# EAGLE design Four Motor Rev F (EAGLE 9.6.2)
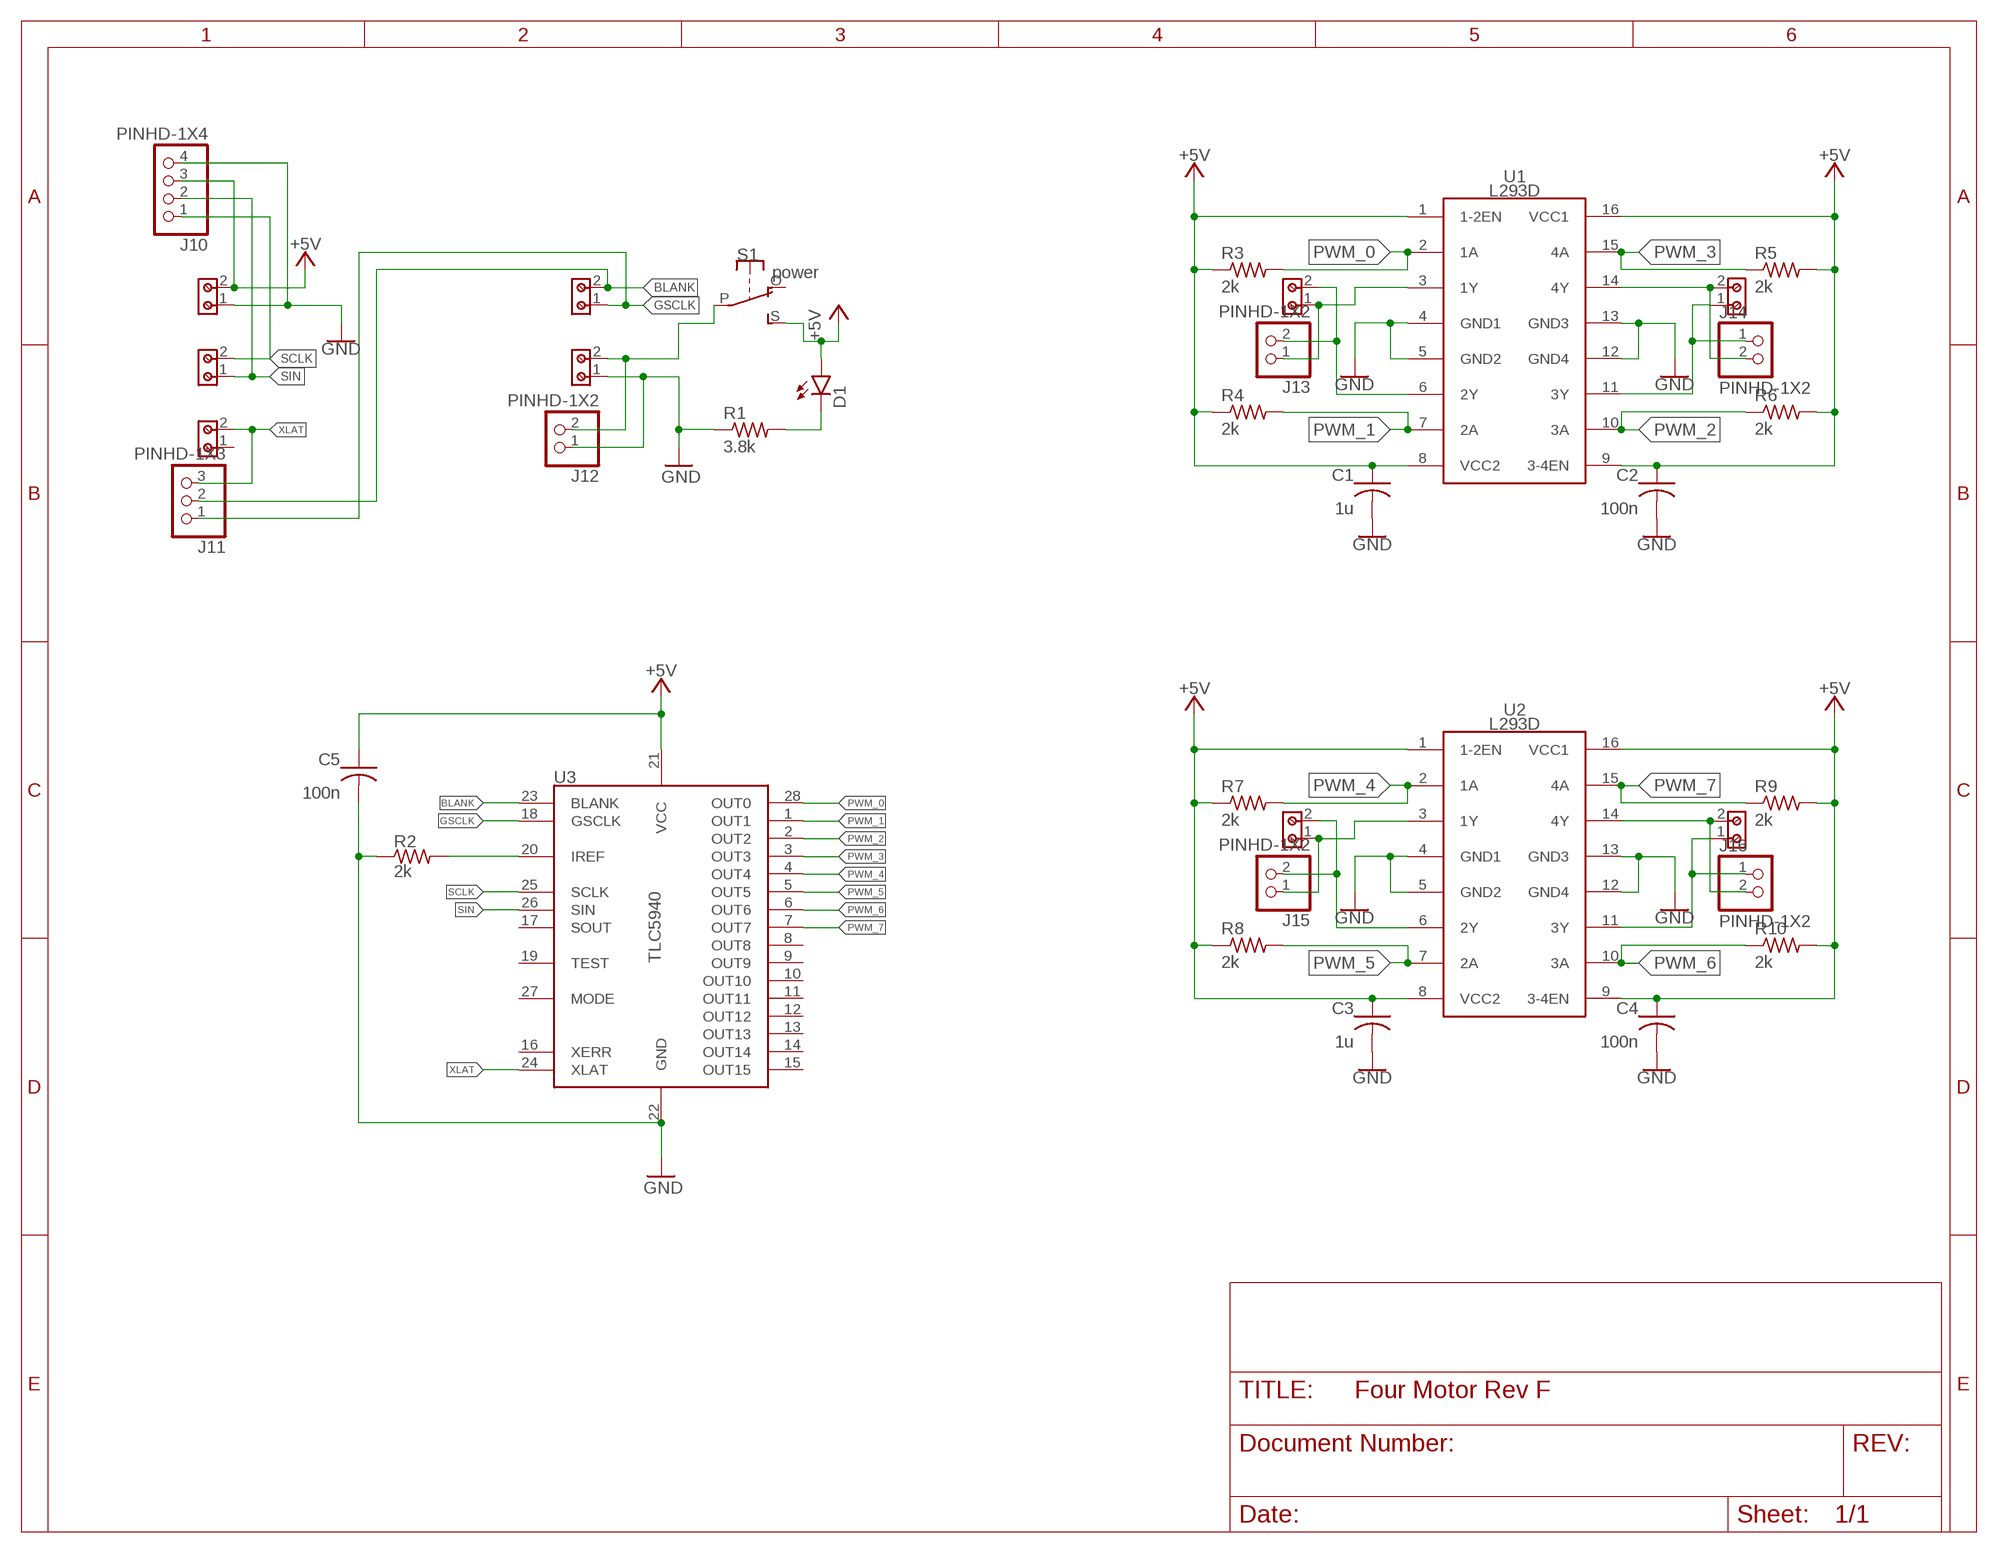
[diagram p0: schematic, sheet 1]

## Parts
C1  1u  THT-CER-CAPACITOR  [C050-024X044]
C2  100n  THT-CER-CAPACITOR  [C050-024X044]
C3  1u  THT-CER-CAPACITOR  [C050-024X044]
C4  100n  THT-CER-CAPACITOR  [C050-024X044]
C5  100n  THT-CER-CAPACITOR  [C050-024X044]
D1  LED  [LED5MM]
J1  691214110002  [691214110002]
J2  691214110002  [691214110002]
J3  691214110002  [691214110002]
J4  691214110002  [691214110002]
J5  691214110002  [691214110002]
J6  691214110002  [691214110002]
J7  691214110002  [691214110002]
J8  691214110002  [691214110002]
J9  691214110002  [691214110002]
J10  PINHD-1X4  [1X04]
J11  PINHD-1X3  [1X03]
J12  PINHD-1X2  [1X02]
J13  PINHD-1X2  [1X02]
J14  PINHD-1X2  [1X02]
J15  PINHD-1X2  [1X02]
J16  PINHD-1X2  [1X02]
R1  3.8k  RESISTOR  [0207/10]
R2  2k  RESISTOR  [0207/10]
R3  2k  RESISTOR  [0207/10]
R4  2k  RESISTOR  [0207/10]
R5  2k  RESISTOR  [0207/10]
R6  2k  RESISTOR  [0207/10]
R7  2k  RESISTOR  [0207/10]
R8  2k  RESISTOR  [0207/10]
R9  2k  RESISTOR  [0207/10]
R10  2k  RESISTOR  [0207/10]
S1  power  SLIDE-SWITCHSIDE  [EG1270-90]
U1  L293D  [DIL16]
U2  L293D  [DIL16]
U3  TLC5940  [DIL28-3]

## Nets
+5V: C1.1 C2.1 C3.1 C4.1 C5.1 D1.A J6.2 J10.3 R3.1 R4.1 R5.2 R6.2 R7.1 R8.1 R9.2 R10.2 S1.S U1.1(1-2EN) U1.8(VCC2) U1.9(3-4EN) U1.16(VCC1) U2.1(1-2EN) U2.8(VCC2) U2.9(3-4EN) U2.16(VCC1) U3.21(VCC)
BLANK: J9.2 J11.2 U3.23(BLANK)
GND: C1.2 C2.2 C3.2 C4.2 C5.2 J1.1 J6.1 J10.4 J12.1 R1.1 R2.1 U1.4(GND1) U1.5(GND2) U1.12(GND4) U1.13(GND3) U2.4(GND1) U2.5(GND2) U2.12(GND4) U2.13(GND3) U3.22(GND)
GSCLK: J9.1 J11.1 U3.18(GSCLK)
N$1: J4.1 J15.1 U2.3(1Y)
N$3: J4.2 J15.2 U2.6(2Y)
N$4: J1.2 J12.2 S1.P
N$5: J5.2 J13.2 U1.6(2Y)
N$6: J2.2 J14.2 U1.14(4Y)
N$7: J2.1 J14.1 U1.11(3Y)
N$8: J3.2 J16.2 U2.14(4Y)
N$9: J3.1 J16.1 U2.11(3Y)
N$10: J5.1 J13.1 U1.3(1Y)
N$16: D1.K(C) R1.2
N$21: R2.2 U3.20(IREF)
PWM_0: R3.2 U1.2(1A) U3.28(OUT0)
PWM_1: R4.2 U1.7(2A) U3.1(OUT1)
PWM_2: R6.1 U1.10(3A) U3.2(OUT2)
PWM_3: R5.1 U1.15(4A) U3.3(OUT3)
PWM_4: R7.2 U2.2(1A) U3.4(OUT4)
PWM_5: R8.2 U2.7(2A) U3.5(OUT5)
PWM_6: R10.1 U2.10(3A) U3.6(OUT6)
PWM_7: R9.1 U2.15(4A) U3.7(OUT7)
SCLK: J7.2 J10.1 U3.25(SCLK)
SIN: J7.1 J10.2 U3.26(SIN)
XLAT: J8.2 J11.3 U3.24(XLAT)
Unconnected: J8.1 S1.O U3.8(OUT8) U3.9(OUT9) U3.10(OUT10) U3.11(OUT11) U3.12(OUT12) U3.13(OUT13) U3.14(OUT14) U3.15(OUT15) U3.16(XERR) U3.17(SOUT) U3.19(TEST) U3.27(MODE)

## Library data of the parts
C1-C5 = Quantum Projects:THT-CER-CAPACITOR
D1 = Quantum Projects:LED
J1-J9 = Wurth_Connectors_WR-TBL Rising Cage Clamp:691214110002: WR-TBL Serie 2141 - 3.50 mm Horiz. Entry Modular KIND PROPERTIES Pitch 3.5 mm MATERIAL PROPERTIES Insulator Material PA66 Insulator Flammability Rating UL94 V-0 Insulator Color Green Contact Material Brass Contact Plating Copper over Zinc Terminal Screw Material Steel Terminal Screw Plating Zinc Wire Guard Material Brass GENERAL INFORMATION Operating Temperature -40 up to +105 °C Compliance Lead free / RoHS ELECTRICAL PROPERTIES IR cULus 10 A Working Voltage [cULus] 300 V (AC) Withstanding Voltage [cULus] 1600 V (AC) Contact Resistance [cULus] 20 mΩ MECHANICAL PROPERTIES Wire Strip Length 5 up to 6 (mm) Screw M2 Solid Wire Section (AWG) 24 to 16 (AWG) Solid Wire Section (Metric) 0.205 to 1.31 (mm²) Stranded Wire Section (AWG) 24 to 16 (AWG) Stranded Wire Section (Metric) 0.205 to 1.31 (mm²) CERTIFICATION cULus Approval E315414 PACKAGING PROPERTIES Packaging Box <https://katalog.we-online.com/media/images/v2/o32858v209%20Family_WR-TBL2_Series2141S.jpg> Details see: https://katalog.we-online.com/en/em/TBL_3_50_2141_HORIZONTAL_ENTRY_MODULAR_69121411000X Updated by Ella Wu 2019-11-12 2019(C) Wurth Elektronik; DATASHEET-URL: https://www.we-online.com/catalog/datasheet/691214110002.pdf; IR-UL: 10A; MOUNT: THT; PART-NUMBER: 691214110002; PINS: 2; PITCH: 3.5mm; TYPE: Horizontal; WIRE: 24 to 16 (AWG) 0.205 to 1.31 (mm²); WORKING-VOLTAGE-UL: 300V (AC)
J10 = Connector:PINHD-1X4: PIN HEADER; CATEGORY: CONNECTOR; SUB-CATEGORY: PIN-HEADER
J11 = Connector:PINHD-1X3: PIN HEADER; CATEGORY: CONNECTOR; SUB-CATEGORY: PIN-HEADER
J12-J16 = Connector:PINHD-1X2: PIN HEADER; CATEGORY: CONNECTOR; SUB-CATEGORY: PIN-HEADER
R1-R10 = Quantum Projects:RESISTOR
S1 = Quantum Projects:SLIDE-SWITCH
U1 U2 = st-microelectronics:L293D: PUSH-PULL 4 CHANNEL DRIVER; MPN: L293D; OC_FARNELL: 9589619; OC_NEWARK: 56P8249
U3 = Quantum Projects:TLC5940

## Net classes
0 default: width 0.25 mm

## Board
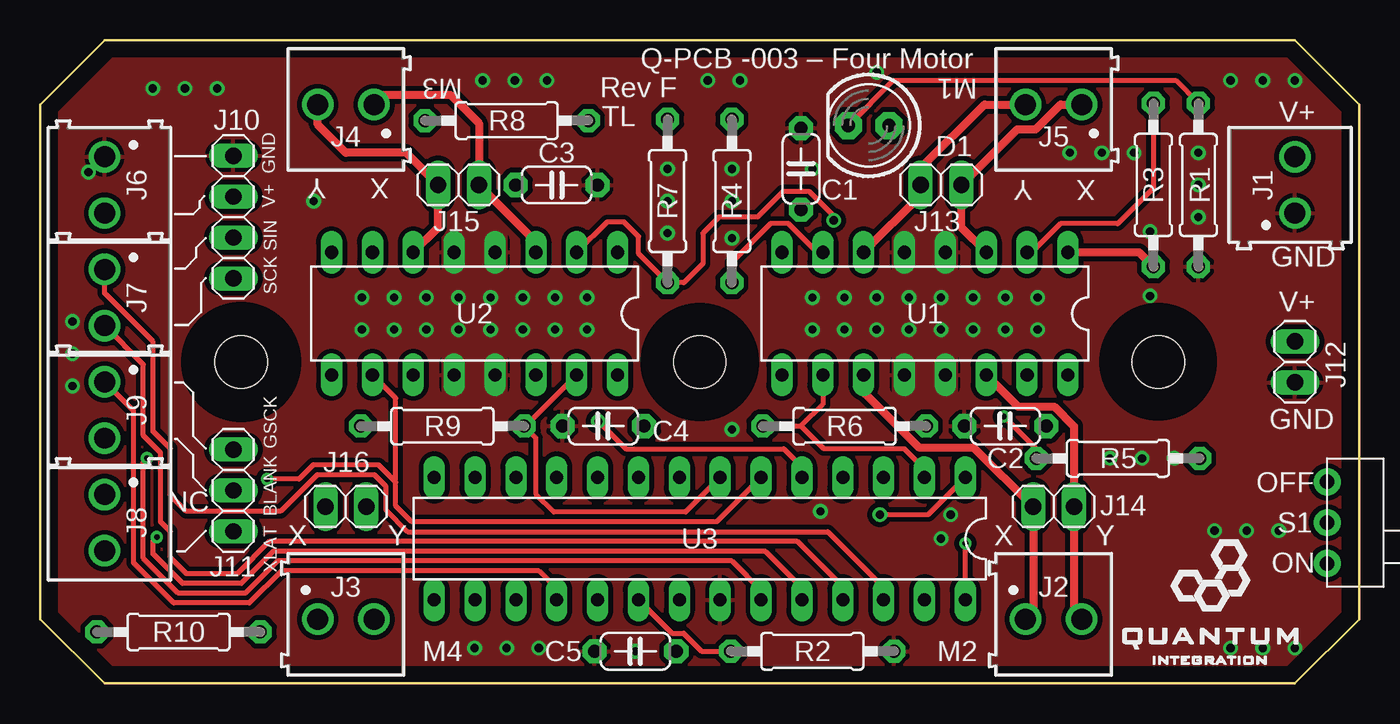
[diagram p1: board, top side]
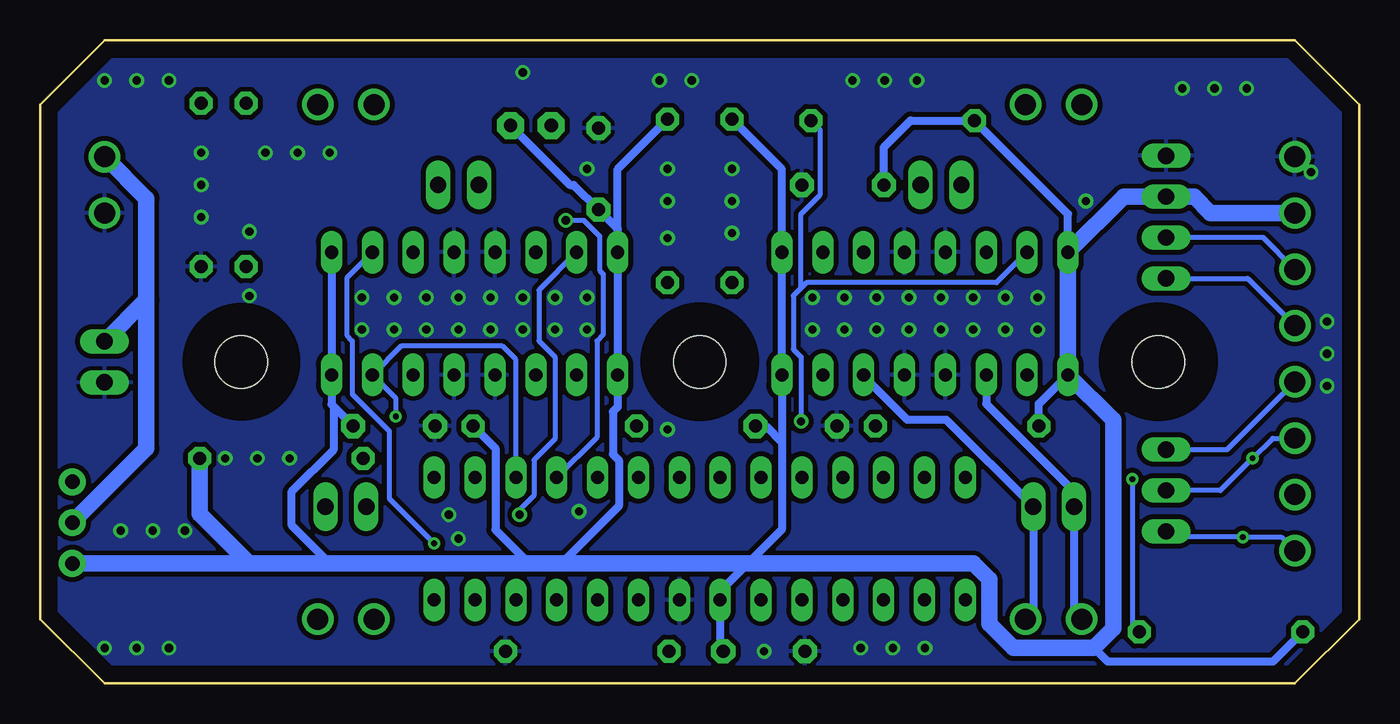
[diagram p2: board, bottom side, seen from below]

Size 82 x 40 mm. Coordinates in mm from the lower left corner, seen from the top.
Outline: 4,0 78,0 82,4 82,36 78,40 4,40 0,36 0,4 4,0
Copper layers (1*16): Top 0.035mm / dielectric 1.5mm / Bottom 0.035mm
Design rules "quantum-drc": minimum track width 12mil, minimum drill 0.35mm, track to track 12mil, track to pad 8mil, pad to pad 12mil, via to via 10mil, smd to smd 6mil, copper to edge 40mil, drill to drill 6mil, minimum pad ring 10mil, minimum via ring 8mil, stop-mask expansion 4mil, vias tented up to drill 50mil, thermal gap 10mil
Holes 3.25 mm at 41,20 12.5,20 69.5,20
tRestrict: area 9.8,17.3 to 15.2,22.7; area 38.3,17.3 to 43.7,22.7; area 66.9,17.4 to 72.1,22.6
bRestrict: area 66.8,17.3 to 72.2,22.7; area 38.3,17.3 to 43.7,22.7; area 9.8,17.3 to 15.2,22.7

### Footprints (pad centres in the part's own frame; a part is rotated, then mirrored left to right if it is on the bottom)
C050-024X044 = drill 0.813 pad 1.5 octagon: 1 -2.54,0; 2 2.54,0
LED5MM = drill 0.813 pad 1.676 octagon: A -1.27,0; K 1.27,0
691214110002 = drill 1.3: 1 -1.75,0; 2 1.75,0
1X04 = drill 1.016 long: 1 -3.81,0; 2 -1.27,0; 3 1.27,0; 4 3.81,0
1X03 = drill 1.016 long: 1 -2.54,0; 2 0,0; 3 2.54,0
1X02 = drill 1.016 long: 1 -1.27,0; 2 1.27,0
0207/10 = drill 0.813 pad 1.43 octagon: 1 -5.08,0; 2 5.08,0
EG1270-90 = drill 0.9 pad 1.676: O -2.54,0; P 0,0; S 2.54,0
DIL16 = drill 0.813 long: 1 -8.89,-3.81; 2 -6.35,-3.81; 3 -3.81,-3.81; 4 -1.27,-3.81; 5 1.27,-3.81; 6 3.81,-3.81; 7 6.35,-3.81; 8 8.89,-3.81; 9 8.89,3.81; 10 6.35,3.81; 11 3.81,3.81; 12 1.27,3.81; 13 -1.27,3.81; 14 -3.81,3.81; 15 -6.35,3.81; 16 -8.89,3.81
DIL28-3 = drill 0.813 long: 1 -16.51,-3.81; 2 -13.97,-3.81; 3 -11.43,-3.81; 4 -8.89,-3.81; 5 -6.35,-3.81; 6 -3.81,-3.81; 7 -1.27,-3.81; 8 1.27,-3.81; 9 3.81,-3.81; 10 6.35,-3.81; 11 8.89,-3.81; 12 11.43,-3.81; 13 13.97,-3.81; 14 16.51,-3.81; 15 16.51,3.81; 16 13.97,3.81; 17 11.43,3.81; 18 8.89,3.81; 19 6.35,3.81; 20 3.81,3.81; 21 1.27,3.81; 22 -1.27,3.81; 23 -3.81,3.81; 24 -6.35,3.81; 25 -8.89,3.81; 26 -11.43,3.81; 27 -13.97,3.81; 28 -16.51,3.81

### Placement (x,y rotation side)
C1  47.3,32 90 top
C2  60,16 180 top
C3  32.1,31 0 top
C4  35,16 180 top
C5  37,2 180 top
D1  51.5,34.7 180 top
J1  78,31 90 top
J2  63,4 0 top
J3  19,4 0 top
J4  19,36 180 top
J5  63,36 180 top
J6  4,31 270 top
J7  4,24 270 top
J8  4,10 270 top
J9  4,17 270 top
J10  12,29 90 top
J11  12,12 270 top
J12  78,20 90 top
J13  56,31 180 top
J14  63,11 0 top
J15  26,31 180 top
J16  19,11 0 top
R1  72,31 90 top
R2  48,2 180 top
R3  69.2,31 90 top
R4  43,30 270 top
R5  67,14 0 top
R6  50,16 0 top
R7  39,30 270 top
R8  29,35 0 top
R9  25,16 180 top
R10  8.6,3.2 180 top
S1  80,10 270 top
U1  55,23 180 top
U2  27,23 180 top
U3  41,9 180 top

### Tracks (layer width: path | path; a pad name or v marks a point on that pad's centre or on a via)
+5V
  Top 0.508: U1.1 68.31,26.81 R3.1
  Bottom 0.508: C5.1 39.73,2.19 U3.21 39.73,5.73 38,7.46 35.89,9.57 35.89,15 | 35.89,15 U2.16 U2.1 35.89,31.97 R7.1 | U1.8 U1.9 46.11,17.19 46.4,16.9 46.4,14.24 46.03,13.87 46.03,11.03 49.6,7.46 | U1.8 46.11,31.97 R4.1 | U1.1 U1.16 63.89,17.35 63.77,17.23 | 63.77,17.23 C2.1 | 63.77,17.23 63.77,14.53 66.4,11.9 66.4,9.86 64,7.46 | 69.16,7.46 69,7.46 | R6.2 53.7,14.62 53.7,9.56 51.6,7.46 | U2.8 18.11,29.19 R8.1 27.9,35 29.56,33.34 C3.1 | D1.A 49.07,31 48.84,31 C1.1 46.11,28.27 U1.8 | C4.1 36.89,16 35.89,15 | R9.2 19.92,17.38 U2.9 | R10.2 5.37,1.35 15.64,1.35 16.51,2.21
  Bottom 1.016: 69,7.46 64,7.46 51.6,7.46 49.6,7.46 38,7.46 24,7.46 23,6.46 23,3.72 21.49,2.21 16.51,2.21 15.3,3.42 15.3,16.38 U2.9 U2.8 14.65,30.27 J10.3 10.27,30.27 9.25,29.25 J6.2 | R5.2 72.08,10.54 69,7.46 | S1.S 69,7.46
BLANK  (via drill 0.36)
  Top 0.305: U3.23 44.81,5.8 43,7.61 14.75,7.61 12.75,5.61 8.59,5.61 6.41,7.79 6.41,13.77 v6.64,14
  Bottom 0.305: J9.2 5.39,15.25 v6.64,14 8.64,12 J11.2
GND  (via drill 0.51)
  other vias: 20,24 20,22 22,22 22,24 24,24 24,22 26,22 26,24 28,24 28,22 30,22 30,24 32,24 32,22 34,22 34,24 48,24 48,22 50,22 52,22 54,22 56,22 58,22 60,22 62,22 62,24 60,24 58,24 56,24 54,24 52,24 50,24 48.5,10.7 56.6,10.5 39,28 39,30 39,32 43,32 43,27.7 43,30 48,32 7,37 9,37 11,37 17,30 37,2 52,38 27,2.2 29,2.2 43,15.8 3,31.8 31,2.2 74,2.2 76,2.2 78,2.2 56,9 2,18.5 2,20.5 2,22.5 73,9.5 75,9.5 77,9.5 69,24.1 69,28.1 72,29 72,31 72,33 64,33 66,33 68,33 41.5,37.5 43.5,37.5 27.5,37.5 29.5,37.5 31.5,37.5 74,37.5 76,37.5 78,37.5 66.5,14 68.5,14 70.5,14
  pour Top (no thermals): 29,29 25,29 25,25 14,25 14,21 25,21 25,17 29,17 29,21 53,21 53,17 57,17 57,21 68,21 68,25 57,25 57,29 53,29 53,25 45,25 44,24 38,24 37,25 29,25
  pour Bottom: 0,36 4,40 78,40 82,36 82,4 78,0 4,0 0,4
  pour Top: 0,36 4,40 78,40 82,36 82,4 78,0 4,0 0,4
GSCLK
  Top 0.305: U3.18 32.11,5.89 31,7 15,7 13,5 8.3,5 5.8,7.5 5.8,16.95 J9.1
  Bottom 0.305: J11.1 8.21,14.54 J9.1
N$1
  Top 0.508: J4.1 21.35,36.6 25.5,36.6 27.27,34.83 J15.1 30.81,27.46 U2.3
N$3
  Top 0.508: U2.6 24.73,28.35 J15.2 22.73,33 19,33 17.25,34.75 J4.2
N$4
  Bottom 1.016: J1.2 75.4,30.15 75.4,23.87 | 75.4,23.87 75.4,14.6 S1.P | J12.2 75.4,23.87
N$5
  Top 0.508: J5.2 58.7,36 54.73,32.03 J13.2 54.73,30.35 U1.6
N$6
  Top 0.508: U1.14 60.78,17.22 63.05,17.22 64.27,15.99 J14.2 64.27,4.48 J2.2
N$7
  Top 0.508: U1.11 51.19,18.12 54.62,14.69 58.02,14.69 61.7,11 J14.1 61.73,4.48 J2.1
N$8
  Bottom 0.508: U2.14 30.81,19.11 28.1,16.4 25.67,16.4 J16.2 20.27,4.48 J3.2
N$9
  Bottom 0.508: U2.11 23.19,17.39 17.73,11.93 J16.1 17.73,4.48 J3.1
N$10
  Top 0.508: U1.3 57.27,28.35 J13.1 60.74,34.47 61.88,34.47 63.42,36 J5.1
N$16
  Top 0.305: D1.K 53.03,37.5 70.58,37.5 R1.2
N$21
  Top 0.305: U3.20 39.26,3.12 40,3.12 41.12,2 R2.2
PWM_0  (via drill 0.36)
  Top 0.305: U3.28 v57.51,8.71 | R3.2 69.2,30.8 66.99,28.59 63.43,28.59 61.65,26.81 U1.2
  Bottom 0.305: v57.51,8.71 60.3,11.5 60.3,15.7 62.6,18 62.6,21.31 62.91,21.62 62.91,25.25 U1.2
PWM_1  (via drill 0.51)
  Top 0.305: v52.2,10.5 55.2,10.5 U3.1 | U1.7 48.29,26.81 46.5,28.6 45.4,28.6 43,26.2 R4.2
  Bottom 0.305: U1.7 51,24.46 51,21.3 50,20.3 50,15.2 51.31,13.89 51.31,11.69 52.2,10.8 v52.2,10.5
PWM_2
  Top 0.305: U1.10 48.65,17.35 47.3,16 | R6.1 47.3,16 | U3.2 54.97,13.33 53.7,14.6 48.7,14.6 47.3,16
PWM_3  (via drill 0.36)
  Top 0.305: v59.9,16.6 61.92,14.58 R5.1
  Bottom 0.305: U3.3 52.43,20.13 53.27,20.97 59.57,20.97 U1.15 59.9,17.74 v59.9,16.6
PWM_4  (via drill 0.51)
  Top 0.305: U2.2 35.24,28.7 36.3,28.7 37.2,27.8 37.2,26.72 R7.2 40.02,24.92 41.2,26.1 41.2,28 42.2,29 44.6,29 46.18,30.58 47.82,30.58 49.32,29.08 v49.32,28.8
  Bottom 0.305: v49.32,28.8 48.22,28.8 47.23,27.81 47.23,25.69 47,25.46 47,21.71 47.4,21.31 47.4,15.3 U3.4
PWM_5  (via drill 0.51)
  Top 0.305: v34.7,16.3 36.41,14.59 46.23,14.59 47.35,13.47 U3.5
  Bottom 0.305: v34.7,16.3 34.7,20.3 35.18,20.78 35.18,24.11 34.7,24.59 | 34.7,24.59 34.38,24.91 22.55,24.91 U2.7 | R8.2 33.5,34.42 33.5,30.4 34.7,29.2 34.7,24.59
PWM_6  (via drill 0.36)
  Top 0.305: U3.6 42.05,10.05 23.1,10.05 22.1,11.05 22.1,12.52 | U2.10 22.1,17.74 22.1,12.52 | 22.1,12.52 21.03,13.59 16.97,13.59 16.09,12.7 v14.11,12.7
  Bottom 0.305: v14.11,12.7 14.11,3.63 R10.1
PWM_7
  Top 0.305: U3.7 40.12,10.66 31.94,10.66 30.8,11.8 30.8,15.28 R9.1 30.16,16 U2.15
SCLK
  Top 0.305: U3.25 49.89,6.01 47.07,8.83 14.24,8.83 12.24,6.83 9.1,6.83 8.09,7.84 8.09,9.45 7.48,10.06 7.48,14.35 6.41,15.41 6.41,19.84 J7.2
  Bottom 0.305: J10.1 6.94,25.19 J7.2
SIN
  Top 0.305: U3.26 52.43,5.97 48.96,9.44 22.85,9.44 21.49,10.8 21.49,12.27 20.77,12.98 17.23,12.98 14.94,10.7 9.09,10.7 8.09,11.7 8.09,14.6 7.02,15.67 7.02,21.26 4,24.27 J7.1
  Bottom 0.305: J7.1 5.98,27.73 J10.2
XLAT  (via drill 0.36)
  Top 0.305: U3.24 47.35,5.95 45.08,8.22 14.49,8.22 12.49,6.22 8.84,6.22 7.02,8.04 7.02,8.87 v7.25,9.1
  Bottom 0.305: J8.2 4.85,9.1 v7.25,9.1 11.64,9.1 J11.3

### Text on the board
tNames: Q-PCB -003 – Four Motor | Rev F | M3 | M1 | TL | V+ | GND | Y | X | Y | X | V+ | SIN | GND | SCK | V+ | GND | GSCK | OFF | NC | BLANK | X | Y | X | Y | ON | XLAT | M4 | M2